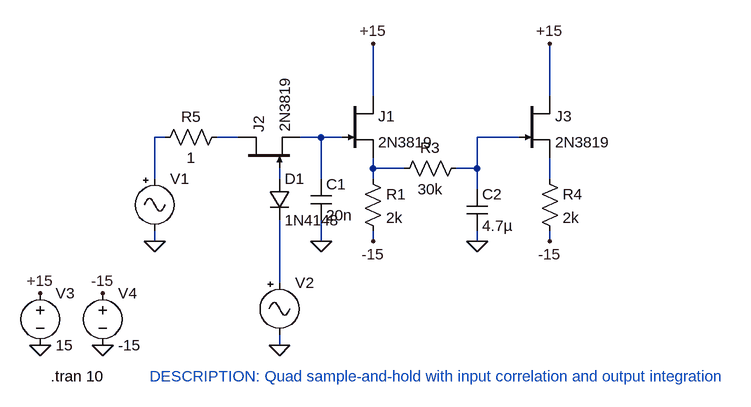
[diagram p0: schematic Dice.asc]
Dice.asc, the LTspice schematic file:
Version 4
SHEET 1 880 680
WIRE 192 -16 192 -96
WIRE 464 -16 464 -96
WIRE -128 48 -144 48
WIRE -16 48 -48 48
WIRE 112 48 80 48
WIRE 144 48 112 48
WIRE 416 48 352 48
WIRE 192 96 192 80
WIRE 240 96 192 96
WIRE 352 96 352 48
WIRE 352 96 320 96
WIRE -144 112 -144 48
WIRE 48 112 48 96
WIRE 112 112 112 48
WIRE 192 112 192 96
WIRE 464 112 464 80
WIRE 352 128 352 96
WIRE -144 208 -144 192
WIRE 112 208 112 176
WIRE 192 208 192 192
WIRE 352 208 352 192
WIRE 464 208 464 192
WIRE 48 272 48 176
WIRE 48 368 48 352
FLAG -144 208 0
FLAG 48 368 0
FLAG 192 208 -15
FLAG -320 368 0
FLAG -320 288 +15
FLAG -224 288 -15
FLAG -224 368 0
FLAG 192 -96 +15
FLAG 112 208 0
FLAG 352 208 0
FLAG 464 208 -15
FLAG 464 -96 +15
SYMBOL njf 144 -16 R0
SYMATTR InstName J1
SYMATTR Value 2N3819
SYMBOL njf -16 96 R270
SYMATTR InstName J2
SYMATTR Value 2N3819
SYMBOL Misc\\signal -144 96 R0
WINDOW 123 0 0 Left 0
WINDOW 39 0 0 Left 0
WINDOW 3 24 104 Invisible 0
SYMATTR Value SFFM(0 5 0.5 59 0.9)
SYMATTR InstName V1
SYMBOL Misc\\signal 48 256 R0
WINDOW 123 0 0 Left 0
WINDOW 39 0 0 Left 0
WINDOW 3 24 104 Invisible 0
SYMATTR Value PULSE(-15 15 0 0 0 0.001 0.31)
SYMATTR InstName V2
SYMBOL voltage -320 272 R0
WINDOW 123 0 0 Left 0
WINDOW 39 0 0 Left 0
SYMATTR InstName V3
SYMATTR Value 15
SYMBOL voltage -224 272 R0
WINDOW 123 0 0 Left 0
WINDOW 39 0 0 Left 0
SYMATTR InstName V4
SYMATTR Value -15
SYMBOL res 176 96 R0
SYMATTR InstName R1
SYMATTR Value 2k
SYMBOL cap 96 112 R0
SYMATTR InstName C1
SYMATTR Value 20n
SYMBOL diode 32 112 R0
SYMATTR InstName D1
SYMATTR Value 1N4148
SYMBOL res 336 80 R90
WINDOW 0 0 56 VBottom 0
WINDOW 3 32 56 VTop 0
SYMATTR InstName R3
SYMATTR Value 30k
SYMBOL cap 336 128 R0
SYMATTR InstName C2
SYMATTR Value 4.7µ
SYMBOL njf 416 -16 R0
SYMATTR InstName J3
SYMATTR Value 2N3819
SYMBOL res 448 96 R0
SYMATTR InstName R4
SYMATTR Value 2k
SYMBOL res -32 32 R90
WINDOW 0 0 56 VBottom 0
WINDOW 3 32 56 VTop 0
SYMATTR InstName R5
SYMATTR Value 1
TEXT -304 416 Left 0 !.tran 10
TEXT -152 416 Left 0 ;DESCRIPTION: Quad sample-and-hold with input correlation and output integration

The netlist it stands for:
* Dice.asc
J1 +15 N003 N005 2N3819
J2 N002 N006 N003 2N3819
V1 N001 0 SFFM(0 5 0.5 59 0.9)
V2 N008 0 PULSE(-15 15 0 0 0 0.001 0.31)
V3 +15 0 15
V4 -15 0 -15
R1 N005 -15 2k
C1 N003 0 20n
D1 N006 N008 1N4148
R3 N004 N005 30k
C2 N004 0 4.7µ
J3 +15 N004 N007 2N3819
R4 N007 -15 2k
R5 N002 N001 1
.model D D
.lib standard.dio
.model NJF NJF
.model PJF PJF
.lib standard.jft
.tran 10
* DESCRIPTION: Quad sample-and-hold with input correlation and output integration
.backanno
.end